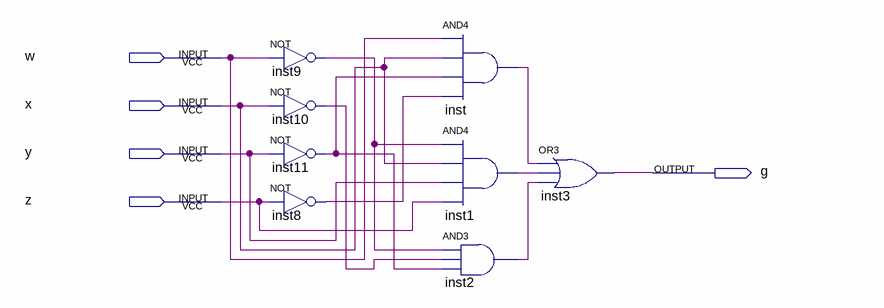
[diagram p0: schematic sheet]
// Quartus schematic G.bdf as structural Verilog: 8 symbols, 5 pins
module G (
  input  w,
  input  x,
  input  y,
  input  z,
  output g
);

  wire inst1_out, inst2_out, inst8_out, inst9_out, inst10_out, inst11_out, inst_out;

  not inst9 (inst9_out, w);
  not inst10 (inst10_out, x);
  not inst11 (inst11_out, y);
  not inst8 (inst8_out, z);
  and inst (inst_out, w, x, inst11_out, inst8_out);
  and inst1 (inst1_out, inst9_out, x, y, z);
  and inst2 (inst2_out, inst9_out, inst10_out, inst11_out);
  or inst3 (g, inst_out, inst1_out, inst2_out);
endmodule
